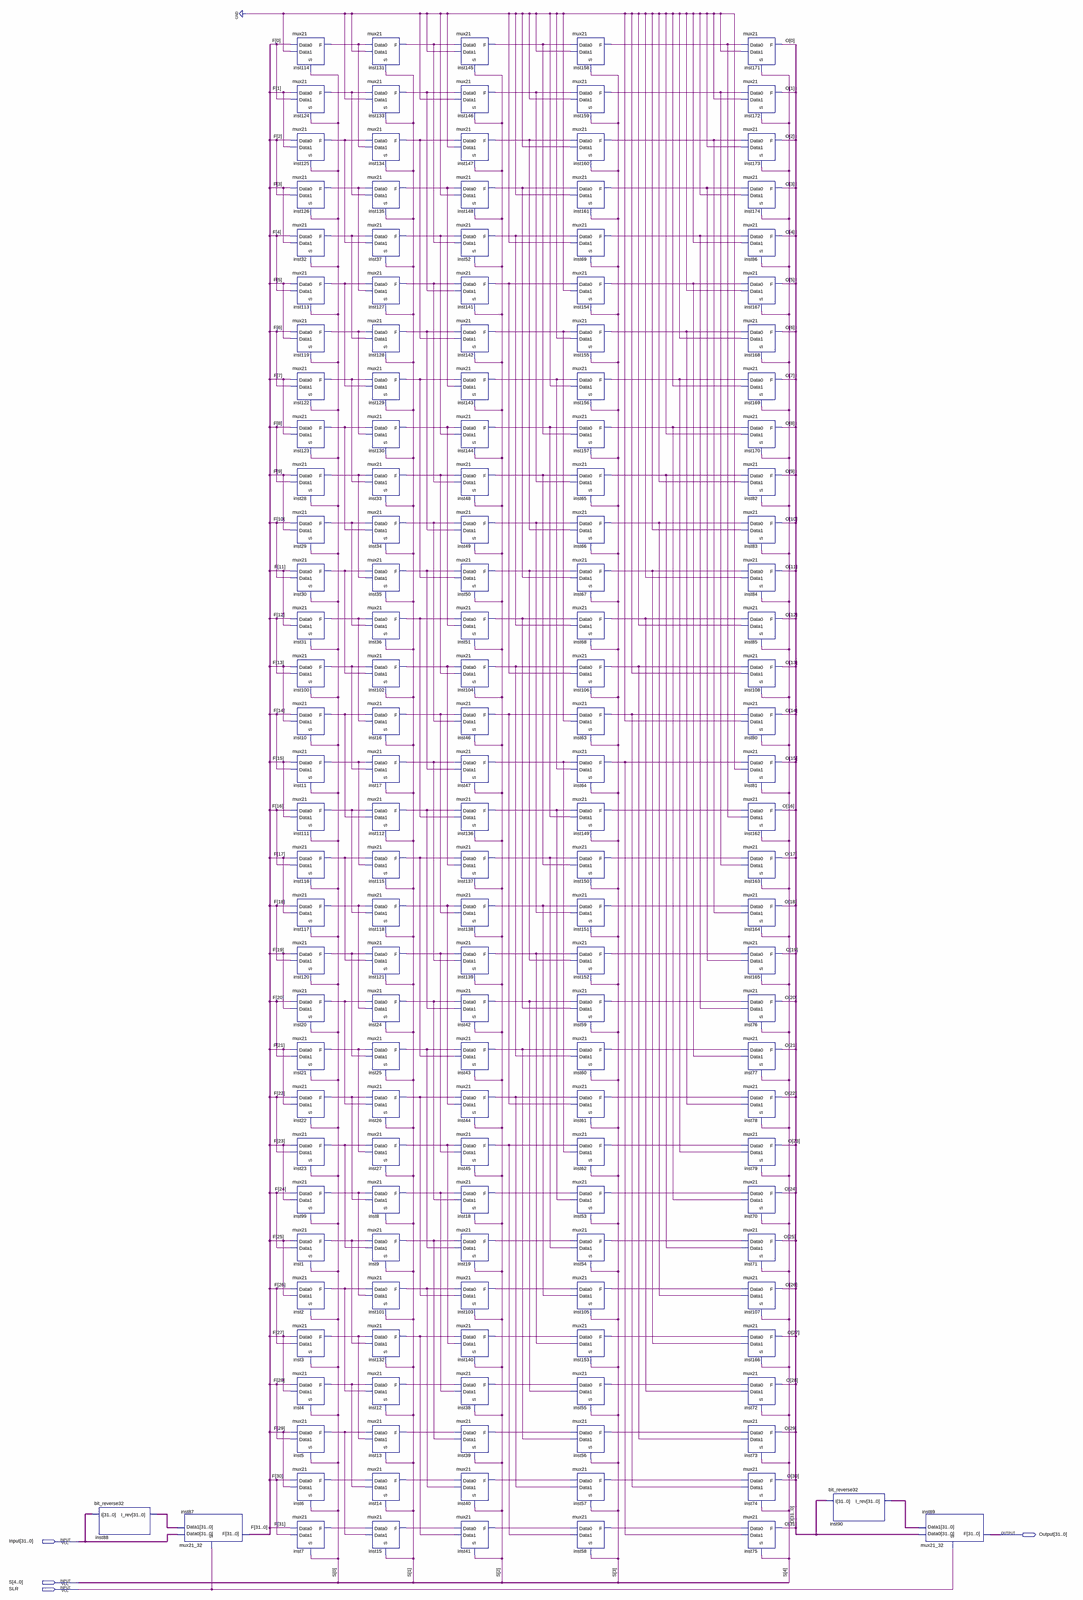
[diagram p0: schematic sheet, whole]
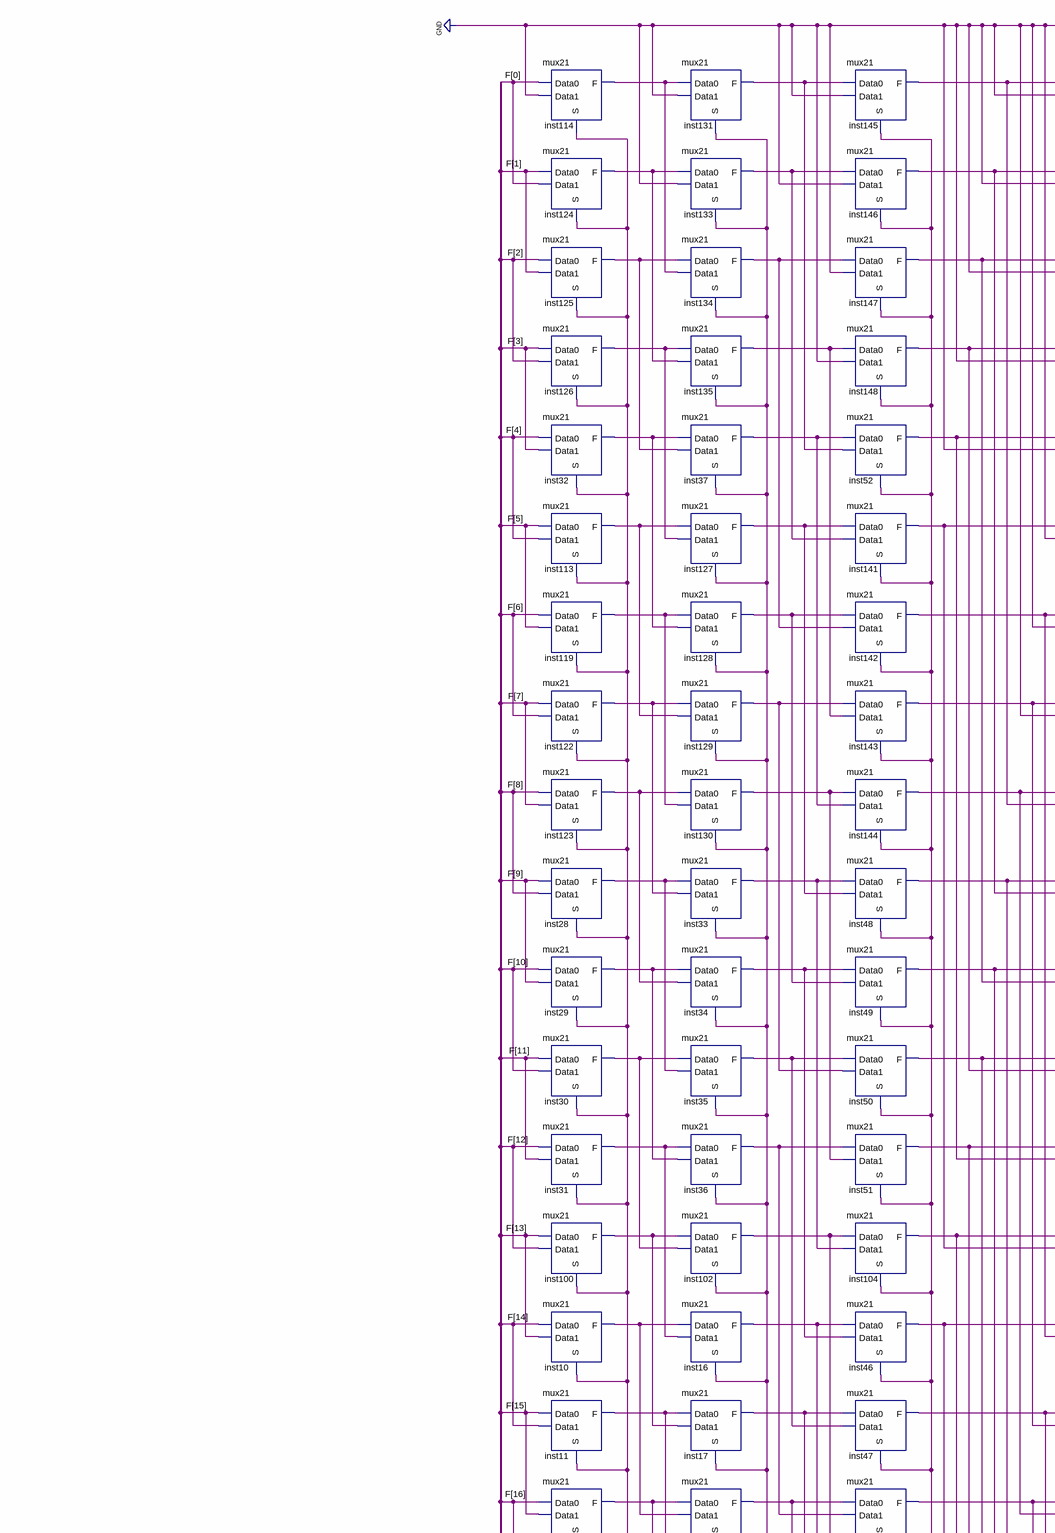
[diagram p1: schematic sheet, upper left part]
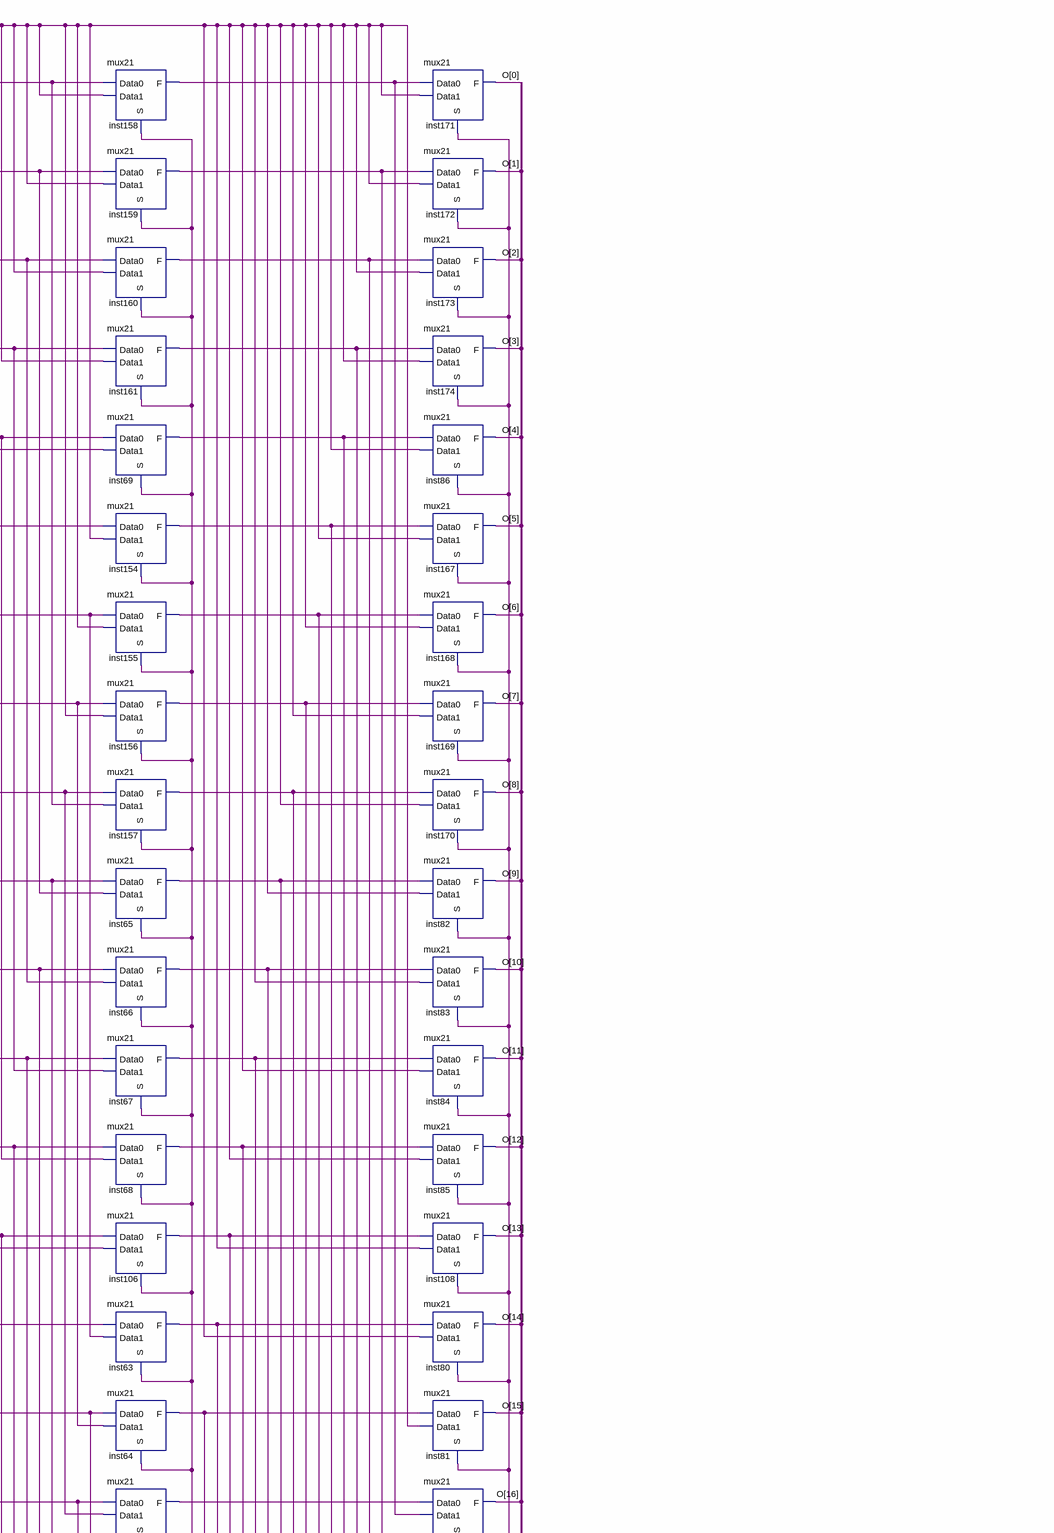
[diagram p2: schematic sheet, upper right part]
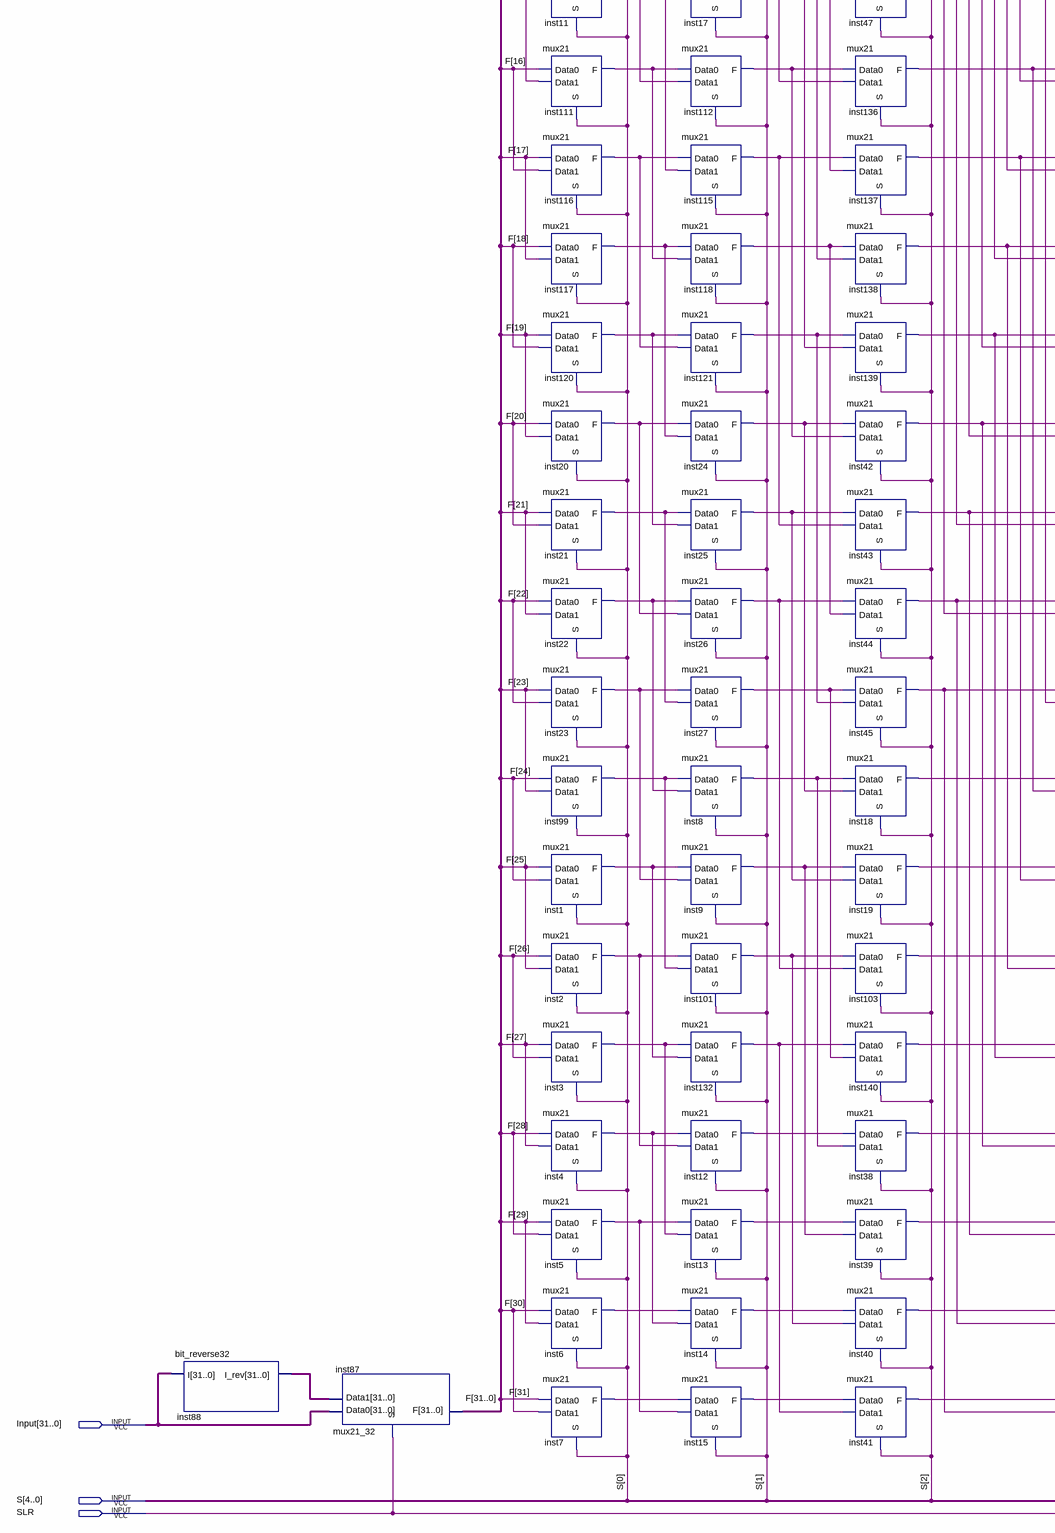
[diagram p3: schematic sheet, lower left part]
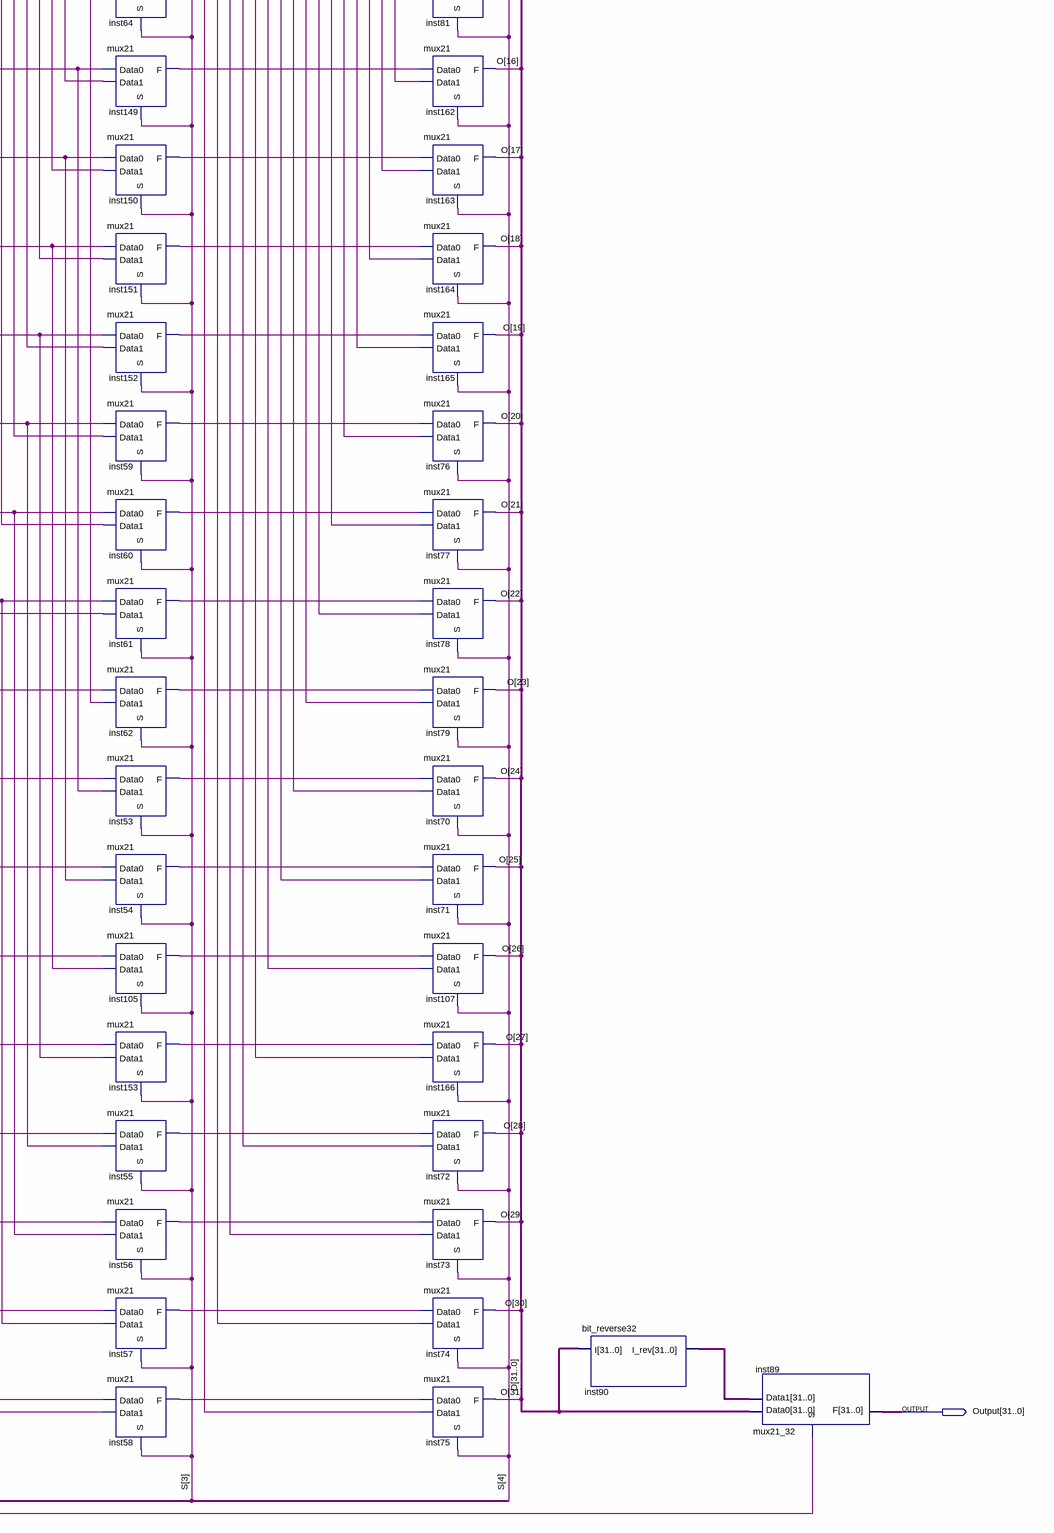
[diagram p4: schematic sheet, lower right part]
// Quartus schematic Shifter.bdf as structural Verilog: 164 symbols, 4 pins
module Shifter (
  input  [31:0] Input,
  input  [4:0] S,
  input  SLR,
  output [31:0] Output
);

  wire inst1_f, inst2_f, inst3_f, inst4_f, inst5_f, inst6_f, inst7_f, inst8_f, inst9_f, inst10_f, inst11_f,
       inst12_f, inst13_f, inst14_f, inst15_f, inst16_f, inst17_f, inst18_f, inst19_f, inst20_f, inst21_f,
       inst22_f, inst23_f, inst24_f, inst25_f, inst26_f, inst27_f, inst28_f, inst29_f, inst30_f, inst31_f,
       inst32_f, inst33_f, inst34_f, inst35_f, inst36_f, inst37_f, inst38_f, inst39_f, inst40_f, inst41_f,
       inst42_f, inst43_f, inst44_f, inst45_f, inst46_f, inst47_f, inst48_f, inst49_f, inst50_f, inst51_f,
       inst52_f, inst53_f, inst54_f, inst55_f, inst56_f, inst57_f, inst58_f, inst59_f, inst60_f, inst61_f,
       inst62_f, inst63_f, inst64_f, inst65_f, inst66_f, inst67_f, inst68_f, inst69_f, inst99_f, inst100_f,
       inst101_f, inst102_f, inst103_f, inst104_f, inst105_f, inst106_f, inst111_f, inst112_f, inst113_f,
       inst114_f, inst115_f, inst116_f, inst117_f, inst118_f, inst119_f, inst120_f, inst121_f, inst122_f,
       inst123_f, inst124_f, inst125_f, inst126_f, inst127_f, inst128_f, inst129_f, inst130_f, inst131_f,
       inst132_f, inst133_f, inst134_f, inst135_f, inst136_f, inst137_f, inst138_f, inst139_f, inst140_f,
       inst141_f, inst142_f, inst143_f, inst144_f, inst145_f, inst146_f, inst147_f, inst148_f, inst149_f,
       inst150_f, inst151_f, inst152_f, inst153_f, inst154_f, inst155_f, inst156_f, inst157_f, inst158_f,
       inst159_f, inst160_f, inst161_f;
  wire [31:0] F, inst88_i_rev, inst90_i_rev, O;

  bit_reverse32 inst88 (.I(Input), .I_rev(inst88_i_rev));
  mux21_32 inst87 (.Data0(Input), .Data1(inst88_i_rev), .S(SLR), .F(F));
  mux21 inst114 (.Data0(F[0]), .Data1(1'b0), .S(S[0]), .F(inst114_f));
  mux21 inst124 (.Data0(F[1]), .Data1(F[0]), .S(S[0]), .F(inst124_f));
  mux21 inst125 (.Data0(F[2]), .Data1(F[1]), .S(S[0]), .F(inst125_f));
  mux21 inst126 (.Data0(F[3]), .Data1(F[2]), .S(S[0]), .F(inst126_f));
  mux21 inst32 (.Data0(F[4]), .Data1(F[3]), .S(S[0]), .F(inst32_f));
  mux21 inst113 (.Data0(F[5]), .Data1(F[4]), .S(S[0]), .F(inst113_f));
  mux21 inst119 (.Data0(F[6]), .Data1(F[5]), .S(S[0]), .F(inst119_f));
  mux21 inst122 (.Data0(F[7]), .Data1(F[6]), .S(S[0]), .F(inst122_f));
  mux21 inst123 (.Data0(F[8]), .Data1(F[7]), .S(S[0]), .F(inst123_f));
  mux21 inst28 (.Data0(F[9]), .Data1(F[8]), .S(S[0]), .F(inst28_f));
  mux21 inst29 (.Data0(F[10]), .Data1(F[9]), .S(S[0]), .F(inst29_f));
  mux21 inst30 (.Data0(F[11]), .Data1(F[10]), .S(S[0]), .F(inst30_f));
  mux21 inst31 (.Data0(F[12]), .Data1(F[11]), .S(S[0]), .F(inst31_f));
  mux21 inst100 (.Data0(F[13]), .Data1(F[12]), .S(S[0]), .F(inst100_f));
  mux21 inst10 (.Data0(F[14]), .Data1(F[13]), .S(S[0]), .F(inst10_f));
  mux21 inst11 (.Data0(F[15]), .Data1(F[14]), .S(S[0]), .F(inst11_f));
  mux21 inst111 (.Data0(F[16]), .Data1(F[15]), .S(S[0]), .F(inst111_f));
  mux21 inst116 (.Data0(F[17]), .Data1(F[16]), .S(S[0]), .F(inst116_f));
  mux21 inst117 (.Data0(F[18]), .Data1(F[17]), .S(S[0]), .F(inst117_f));
  mux21 inst120 (.Data0(F[19]), .Data1(F[18]), .S(S[0]), .F(inst120_f));
  mux21 inst20 (.Data0(F[20]), .Data1(F[19]), .S(S[0]), .F(inst20_f));
  mux21 inst21 (.Data0(F[21]), .Data1(F[20]), .S(S[0]), .F(inst21_f));
  mux21 inst22 (.Data0(F[22]), .Data1(F[21]), .S(S[0]), .F(inst22_f));
  mux21 inst23 (.Data0(F[23]), .Data1(F[22]), .S(S[0]), .F(inst23_f));
  mux21 inst99 (.Data0(F[24]), .Data1(F[23]), .S(S[0]), .F(inst99_f));
  mux21 inst1 (.Data0(F[25]), .Data1(F[24]), .S(S[0]), .F(inst1_f));
  mux21 inst2 (.Data0(F[26]), .Data1(F[25]), .S(S[0]), .F(inst2_f));
  mux21 inst3 (.Data0(F[27]), .Data1(F[26]), .S(S[0]), .F(inst3_f));
  mux21 inst4 (.Data0(F[28]), .Data1(F[27]), .S(S[0]), .F(inst4_f));
  mux21 inst5 (.Data0(F[29]), .Data1(F[28]), .S(S[0]), .F(inst5_f));
  mux21 inst6 (.Data0(F[30]), .Data1(F[29]), .S(S[0]), .F(inst6_f));
  mux21 inst7 (.Data0(F[31]), .Data1(F[30]), .S(S[0]), .F(inst7_f));
  mux21 inst131 (.Data0(inst114_f), .Data1(1'b0), .S(S[1]), .F(inst131_f));
  mux21 inst133 (.Data0(inst124_f), .Data1(1'b0), .S(S[1]), .F(inst133_f));
  mux21 inst134 (.Data0(inst125_f), .Data1(inst114_f), .S(S[1]), .F(inst134_f));
  mux21 inst135 (.Data0(inst126_f), .Data1(inst124_f), .S(S[1]), .F(inst135_f));
  mux21 inst37 (.Data0(inst32_f), .Data1(inst125_f), .S(S[1]), .F(inst37_f));
  mux21 inst127 (.Data0(inst113_f), .Data1(inst126_f), .S(S[1]), .F(inst127_f));
  mux21 inst128 (.Data0(inst119_f), .Data1(inst32_f), .S(S[1]), .F(inst128_f));
  mux21 inst129 (.Data0(inst122_f), .Data1(inst113_f), .S(S[1]), .F(inst129_f));
  mux21 inst130 (.Data0(inst123_f), .Data1(inst119_f), .S(S[1]), .F(inst130_f));
  mux21 inst33 (.Data0(inst28_f), .Data1(inst122_f), .S(S[1]), .F(inst33_f));
  mux21 inst34 (.Data0(inst29_f), .Data1(inst123_f), .S(S[1]), .F(inst34_f));
  mux21 inst35 (.Data0(inst30_f), .Data1(inst28_f), .S(S[1]), .F(inst35_f));
  mux21 inst36 (.Data0(inst31_f), .Data1(inst29_f), .S(S[1]), .F(inst36_f));
  mux21 inst102 (.Data0(inst100_f), .Data1(inst30_f), .S(S[1]), .F(inst102_f));
  mux21 inst16 (.Data0(inst10_f), .Data1(inst31_f), .S(S[1]), .F(inst16_f));
  mux21 inst17 (.Data0(inst11_f), .Data1(inst100_f), .S(S[1]), .F(inst17_f));
  mux21 inst112 (.Data0(inst111_f), .Data1(inst10_f), .S(S[1]), .F(inst112_f));
  mux21 inst115 (.Data0(inst116_f), .Data1(inst11_f), .S(S[1]), .F(inst115_f));
  mux21 inst118 (.Data0(inst117_f), .Data1(inst111_f), .S(S[1]), .F(inst118_f));
  mux21 inst121 (.Data0(inst120_f), .Data1(inst116_f), .S(S[1]), .F(inst121_f));
  mux21 inst24 (.Data0(inst20_f), .Data1(inst117_f), .S(S[1]), .F(inst24_f));
  mux21 inst25 (.Data0(inst21_f), .Data1(inst120_f), .S(S[1]), .F(inst25_f));
  mux21 inst26 (.Data0(inst22_f), .Data1(inst20_f), .S(S[1]), .F(inst26_f));
  mux21 inst27 (.Data0(inst23_f), .Data1(inst21_f), .S(S[1]), .F(inst27_f));
  mux21 inst8 (.Data0(inst99_f), .Data1(inst22_f), .S(S[1]), .F(inst8_f));
  mux21 inst9 (.Data0(inst1_f), .Data1(inst23_f), .S(S[1]), .F(inst9_f));
  mux21 inst101 (.Data0(inst2_f), .Data1(inst99_f), .S(S[1]), .F(inst101_f));
  mux21 inst132 (.Data0(inst3_f), .Data1(inst1_f), .S(S[1]), .F(inst132_f));
  mux21 inst12 (.Data0(inst4_f), .Data1(inst2_f), .S(S[1]), .F(inst12_f));
  mux21 inst13 (.Data0(inst5_f), .Data1(inst3_f), .S(S[1]), .F(inst13_f));
  mux21 inst14 (.Data0(inst6_f), .Data1(inst4_f), .S(S[1]), .F(inst14_f));
  mux21 inst15 (.Data0(inst7_f), .Data1(inst5_f), .S(S[1]), .F(inst15_f));
  mux21 inst145 (.Data0(inst131_f), .Data1(1'b0), .S(S[2]), .F(inst145_f));
  mux21 inst146 (.Data0(inst133_f), .Data1(1'b0), .S(S[2]), .F(inst146_f));
  mux21 inst147 (.Data0(inst134_f), .Data1(1'b0), .S(S[2]), .F(inst147_f));
  mux21 inst148 (.Data0(inst135_f), .Data1(1'b0), .S(S[2]), .F(inst148_f));
  mux21 inst52 (.Data0(inst37_f), .Data1(inst131_f), .S(S[2]), .F(inst52_f));
  mux21 inst141 (.Data0(inst127_f), .Data1(inst133_f), .S(S[2]), .F(inst141_f));
  mux21 inst142 (.Data0(inst128_f), .Data1(inst134_f), .S(S[2]), .F(inst142_f));
  mux21 inst143 (.Data0(inst129_f), .Data1(inst135_f), .S(S[2]), .F(inst143_f));
  mux21 inst144 (.Data0(inst130_f), .Data1(inst37_f), .S(S[2]), .F(inst144_f));
  mux21 inst48 (.Data0(inst33_f), .Data1(inst127_f), .S(S[2]), .F(inst48_f));
  mux21 inst49 (.Data0(inst34_f), .Data1(inst128_f), .S(S[2]), .F(inst49_f));
  mux21 inst50 (.Data0(inst35_f), .Data1(inst129_f), .S(S[2]), .F(inst50_f));
  mux21 inst51 (.Data0(inst36_f), .Data1(inst130_f), .S(S[2]), .F(inst51_f));
  mux21 inst104 (.Data0(inst102_f), .Data1(inst33_f), .S(S[2]), .F(inst104_f));
  mux21 inst46 (.Data0(inst16_f), .Data1(inst34_f), .S(S[2]), .F(inst46_f));
  mux21 inst47 (.Data0(inst17_f), .Data1(inst35_f), .S(S[2]), .F(inst47_f));
  mux21 inst136 (.Data0(inst112_f), .Data1(inst36_f), .S(S[2]), .F(inst136_f));
  mux21 inst137 (.Data0(inst115_f), .Data1(inst102_f), .S(S[2]), .F(inst137_f));
  mux21 inst138 (.Data0(inst118_f), .Data1(inst16_f), .S(S[2]), .F(inst138_f));
  mux21 inst139 (.Data0(inst121_f), .Data1(inst17_f), .S(S[2]), .F(inst139_f));
  mux21 inst42 (.Data0(inst24_f), .Data1(inst112_f), .S(S[2]), .F(inst42_f));
  mux21 inst43 (.Data0(inst25_f), .Data1(inst115_f), .S(S[2]), .F(inst43_f));
  mux21 inst44 (.Data0(inst26_f), .Data1(inst118_f), .S(S[2]), .F(inst44_f));
  mux21 inst45 (.Data0(inst27_f), .Data1(inst121_f), .S(S[2]), .F(inst45_f));
  mux21 inst18 (.Data0(inst8_f), .Data1(inst24_f), .S(S[2]), .F(inst18_f));
  mux21 inst19 (.Data0(inst9_f), .Data1(inst25_f), .S(S[2]), .F(inst19_f));
  mux21 inst103 (.Data0(inst101_f), .Data1(inst26_f), .S(S[2]), .F(inst103_f));
  mux21 inst140 (.Data0(inst132_f), .Data1(inst27_f), .S(S[2]), .F(inst140_f));
  mux21 inst38 (.Data0(inst12_f), .Data1(inst8_f), .S(S[2]), .F(inst38_f));
  mux21 inst39 (.Data0(inst13_f), .Data1(inst9_f), .S(S[2]), .F(inst39_f));
  mux21 inst40 (.Data0(inst14_f), .Data1(inst101_f), .S(S[2]), .F(inst40_f));
  mux21 inst41 (.Data0(inst15_f), .Data1(inst132_f), .S(S[2]), .F(inst41_f));
  mux21 inst158 (.Data0(inst145_f), .Data1(1'b0), .S(S[3]), .F(inst158_f));
  mux21 inst159 (.Data0(inst146_f), .Data1(1'b0), .S(S[3]), .F(inst159_f));
  mux21 inst160 (.Data0(inst147_f), .Data1(1'b0), .S(S[3]), .F(inst160_f));
  mux21 inst161 (.Data0(inst148_f), .Data1(1'b0), .S(S[3]), .F(inst161_f));
  mux21 inst69 (.Data0(inst52_f), .Data1(1'b0), .S(S[3]), .F(inst69_f));
  mux21 inst154 (.Data0(inst141_f), .Data1(1'b0), .S(S[3]), .F(inst154_f));
  mux21 inst155 (.Data0(inst142_f), .Data1(1'b0), .S(S[3]), .F(inst155_f));
  mux21 inst156 (.Data0(inst143_f), .Data1(1'b0), .S(S[3]), .F(inst156_f));
  mux21 inst157 (.Data0(inst144_f), .Data1(inst145_f), .S(S[3]), .F(inst157_f));
  mux21 inst65 (.Data0(inst48_f), .Data1(inst146_f), .S(S[3]), .F(inst65_f));
  mux21 inst66 (.Data0(inst49_f), .Data1(inst147_f), .S(S[3]), .F(inst66_f));
  mux21 inst67 (.Data0(inst50_f), .Data1(inst148_f), .S(S[3]), .F(inst67_f));
  mux21 inst68 (.Data0(inst51_f), .Data1(inst52_f), .S(S[3]), .F(inst68_f));
  mux21 inst106 (.Data0(inst104_f), .Data1(inst141_f), .S(S[3]), .F(inst106_f));
  mux21 inst63 (.Data0(inst46_f), .Data1(inst142_f), .S(S[3]), .F(inst63_f));
  mux21 inst64 (.Data0(inst47_f), .Data1(inst143_f), .S(S[3]), .F(inst64_f));
  mux21 inst149 (.Data0(inst136_f), .Data1(inst144_f), .S(S[3]), .F(inst149_f));
  mux21 inst150 (.Data0(inst137_f), .Data1(inst48_f), .S(S[3]), .F(inst150_f));
  mux21 inst151 (.Data0(inst138_f), .Data1(inst49_f), .S(S[3]), .F(inst151_f));
  mux21 inst152 (.Data0(inst139_f), .Data1(inst50_f), .S(S[3]), .F(inst152_f));
  mux21 inst59 (.Data0(inst42_f), .Data1(inst51_f), .S(S[3]), .F(inst59_f));
  mux21 inst60 (.Data0(inst43_f), .Data1(inst104_f), .S(S[3]), .F(inst60_f));
  mux21 inst61 (.Data0(inst44_f), .Data1(inst46_f), .S(S[3]), .F(inst61_f));
  mux21 inst62 (.Data0(inst45_f), .Data1(inst47_f), .S(S[3]), .F(inst62_f));
  mux21 inst53 (.Data0(inst18_f), .Data1(inst136_f), .S(S[3]), .F(inst53_f));
  mux21 inst54 (.Data0(inst19_f), .Data1(inst137_f), .S(S[3]), .F(inst54_f));
  mux21 inst105 (.Data0(inst103_f), .Data1(inst138_f), .S(S[3]), .F(inst105_f));
  mux21 inst153 (.Data0(inst140_f), .Data1(inst139_f), .S(S[3]), .F(inst153_f));
  mux21 inst55 (.Data0(inst38_f), .Data1(inst42_f), .S(S[3]), .F(inst55_f));
  mux21 inst56 (.Data0(inst39_f), .Data1(inst43_f), .S(S[3]), .F(inst56_f));
  mux21 inst57 (.Data0(inst40_f), .Data1(inst44_f), .S(S[3]), .F(inst57_f));
  mux21 inst58 (.Data0(inst41_f), .Data1(inst45_f), .S(S[3]), .F(inst58_f));
  mux21 inst171 (.Data0(inst158_f), .Data1(1'b0), .S(S[4]), .F(O[0]));
  mux21 inst172 (.Data0(inst159_f), .Data1(1'b0), .S(S[4]), .F(O[1]));
  mux21 inst173 (.Data0(inst160_f), .Data1(1'b0), .S(S[4]), .F(O[2]));
  mux21 inst174 (.Data0(inst161_f), .Data1(1'b0), .S(S[4]), .F(O[3]));
  mux21 inst86 (.Data0(inst69_f), .Data1(1'b0), .S(S[4]), .F(O[4]));
  mux21 inst167 (.Data0(inst154_f), .Data1(1'b0), .S(S[4]), .F(O[5]));
  mux21 inst168 (.Data0(inst155_f), .Data1(1'b0), .S(S[4]), .F(O[6]));
  mux21 inst169 (.Data0(inst156_f), .Data1(1'b0), .S(S[4]), .F(O[7]));
  mux21 inst170 (.Data0(inst157_f), .Data1(1'b0), .S(S[4]), .F(O[8]));
  mux21 inst82 (.Data0(inst65_f), .Data1(1'b0), .S(S[4]), .F(O[9]));
  mux21 inst83 (.Data0(inst66_f), .Data1(1'b0), .S(S[4]), .F(O[10]));
  mux21 inst84 (.Data0(inst67_f), .Data1(1'b0), .S(S[4]), .F(O[11]));
  mux21 inst85 (.Data0(inst68_f), .Data1(1'b0), .S(S[4]), .F(O[12]));
  mux21 inst108 (.Data0(inst106_f), .Data1(1'b0), .S(S[4]), .F(O[13]));
  mux21 inst80 (.Data0(inst63_f), .Data1(1'b0), .S(S[4]), .F(O[14]));
  mux21 inst81 (.Data0(inst64_f), .Data1(1'b0), .S(S[4]), .F(O[15]));
  mux21 inst162 (.Data0(inst149_f), .Data1(inst158_f), .S(S[4]), .F(O[16]));
  mux21 inst163 (.Data0(inst150_f), .Data1(inst159_f), .S(S[4]), .F(O[17]));
  mux21 inst164 (.Data0(inst151_f), .Data1(inst160_f), .S(S[4]), .F(O[18]));
  mux21 inst165 (.Data0(inst152_f), .Data1(inst161_f), .S(S[4]), .F(O[19]));
  mux21 inst76 (.Data0(inst59_f), .Data1(inst69_f), .S(S[4]), .F(O[20]));
  mux21 inst77 (.Data0(inst60_f), .Data1(inst154_f), .S(S[4]), .F(O[21]));
  mux21 inst78 (.Data0(inst61_f), .Data1(inst155_f), .S(S[4]), .F(O[22]));
  mux21 inst79 (.Data0(inst62_f), .Data1(inst156_f), .S(S[4]), .F(O[23]));
  mux21 inst70 (.Data0(inst53_f), .Data1(inst157_f), .S(S[4]), .F(O[24]));
  mux21 inst71 (.Data0(inst54_f), .Data1(inst65_f), .S(S[4]), .F(O[25]));
  mux21 inst107 (.Data0(inst105_f), .Data1(inst66_f), .S(S[4]), .F(O[26]));
  mux21 inst166 (.Data0(inst153_f), .Data1(inst67_f), .S(S[4]), .F(O[27]));
  mux21 inst72 (.Data0(inst55_f), .Data1(inst68_f), .S(S[4]), .F(O[28]));
  mux21 inst73 (.Data0(inst56_f), .Data1(inst106_f), .S(S[4]), .F(O[29]));
  mux21 inst74 (.Data0(inst57_f), .Data1(inst63_f), .S(S[4]), .F(O[30]));
  mux21 inst75 (.Data0(inst58_f), .Data1(inst64_f), .S(S[4]), .F(O[31]));
  bit_reverse32 inst90 (.I(O), .I_rev(inst90_i_rev));
  mux21_32 inst89 (.Data0(O), .Data1(inst90_i_rev), .S(SLR), .F(Output));
endmodule
